# EAGLE design 4HP_555_eg (EAGLE 8.1.1)
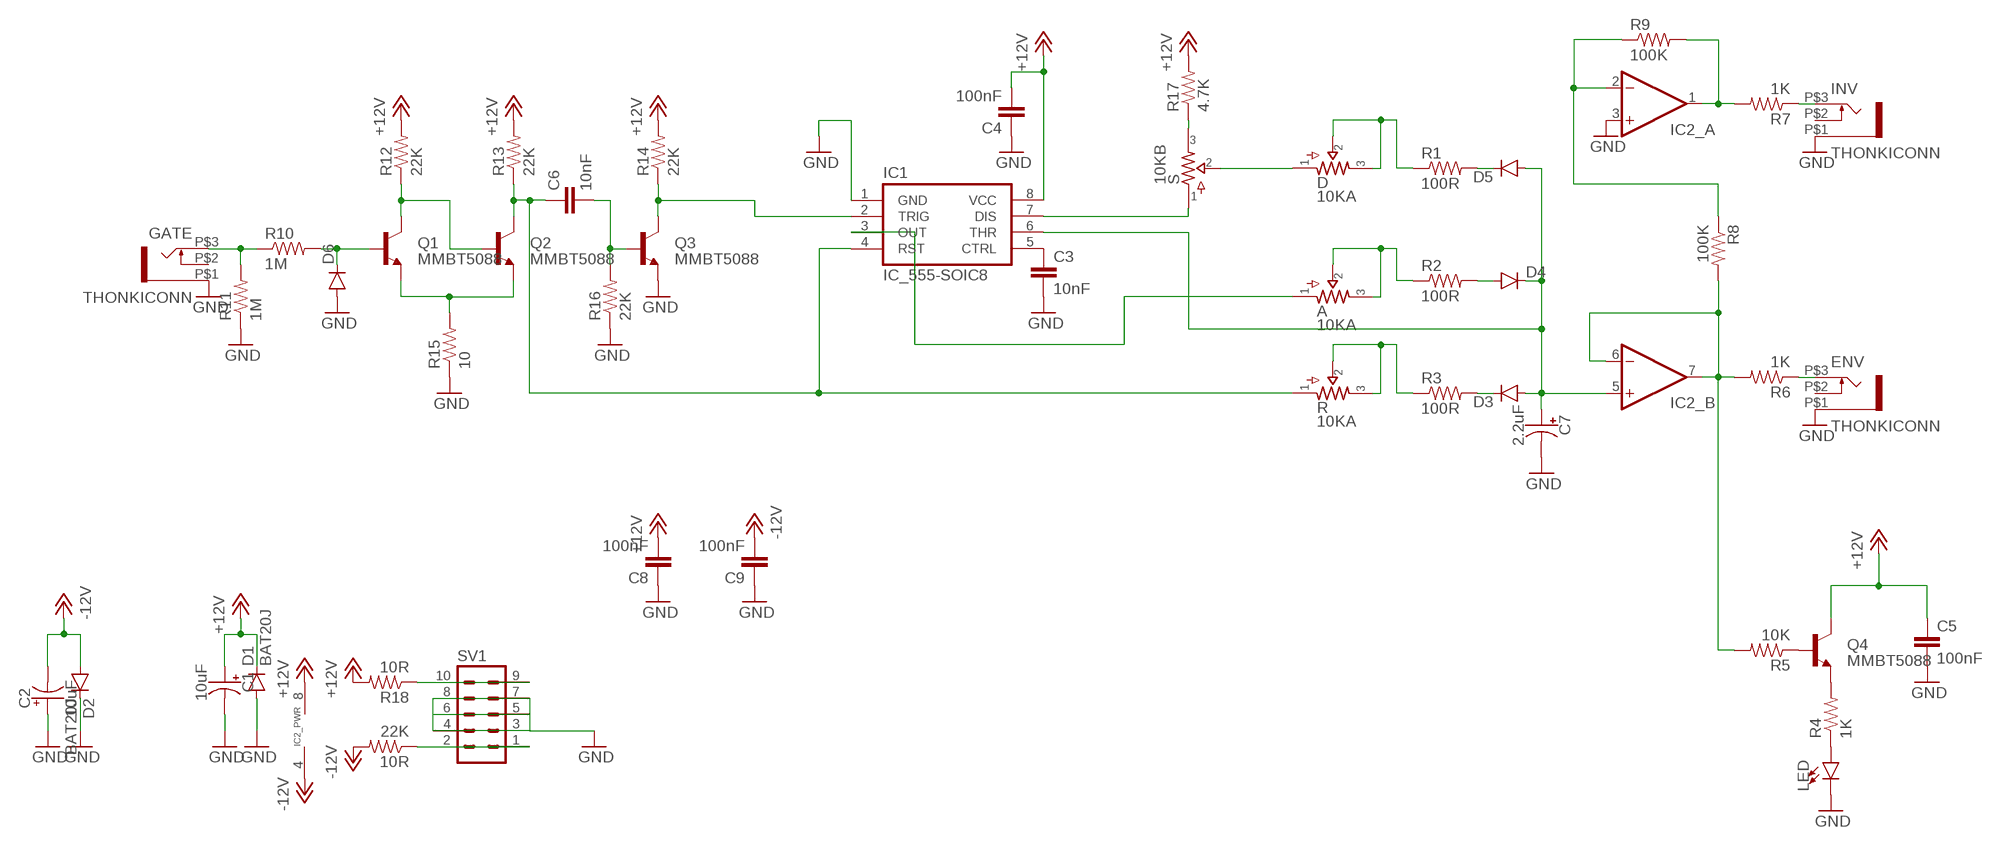
[diagram p0: schematic, sheet 1]

## Parts
10R  22K  RESISTOR0603-RES  [0603-RES]
A  10KA  POTS9MM_MOUNTED_2MMH  [9MM_W/MOUNTS-2MMHOLES]
C1  10uF  0501  [050_020_1]
C2  10uF  0501  [050_020_1]
C3  10nF  CAP0603-CAP  [0603-CAP]
C4  100nF  CAP0603-CAP  [0603-CAP]
C5  100nF  CAP0603-CAP  [0603-CAP]
C6  10nF  CAP0603-CAP  [0603-CAP]
C7  2.2uF  0501  [050_020_1]
C8  100nF  CAP0603-CAP  [0603-CAP]
C9  100nF  CAP0603-CAP  [0603-CAP]
D  10KA  POTS9MM_MOUNTED_2MMH  [9MM_W/MOUNTS-2MMHOLES]
D1  BAT20J  DIODESOD123  [SOD-123]
D2  BAT20J  DIODESOD123  [SOD-123]
D3  DIODESOD  [SOD-323]
D4  DIODESOD  [SOD-323]
D5  DIODESOD  [SOD-323]
D6  DIODESOD  [SOD-323]
ENV  THONKICONN  [THONKICONN]
GATE  THONKICONN  [THONKICONN]
IC1  IC_555-SOIC8  [SOIC-8]
IC2  DUALSMD  [SO08]
INV  THONKICONN  [THONKICONN]
LED  LED5MM  [LED_5MM]
Q1  MMBT5088  TRANSISTOR_NPNMMBT5088  [SOT23]
Q2  MMBT5088  TRANSISTOR_NPNMMBT5088  [SOT23]
Q3  MMBT5088  TRANSISTOR_NPNMMBT5088  [SOT23]
Q4  MMBT5088  TRANSISTOR_NPNMMBT5088  [SOT23]
R  10KA  POTS9MM_MOUNTED_2MMH  [9MM_W/MOUNTS-2MMHOLES]
R1  100R  RESISTOR0603-RES  [0603-RES]
R2  100R  RESISTOR0603-RES  [0603-RES]
R3  100R  RESISTOR0603-RES  [0603-RES]
R4  1K  RESISTOR0603-RES  [0603-RES]
R5  10K  RESISTOR0603-RES  [0603-RES]
R6  1K  RESISTOR0603-RES  [0603-RES]
R7  1K  RESISTOR0603-RES  [0603-RES]
R8  100K  RESISTOR0603-RES  [0603-RES]
R9  100K  RESISTOR0603-RES  [0603-RES]
R10  1M  RESISTOR0603-RES  [0603-RES]
R11  1M  RESISTOR0603-RES  [0603-RES]
R12  22K  RESISTOR0603-RES  [0603-RES]
R13  22K  RESISTOR0603-RES  [0603-RES]
R14  22K  RESISTOR0603-RES  [0603-RES]
R15  10  RESISTOR0603-RES  [0603-RES]
R16  22K  RESISTOR0603-RES  [0603-RES]
R17  4.7K  RESISTOR0603-RES  [0603-RES]
R18  10R  RESISTOR0603-RES  [0603-RES]
S  10KB  POTS9MM_MOUNTED_2MMH  [9MM_W/MOUNTS-2MMHOLES]
SV1  EURO_POWER_HEADER  [EURO_POWER_HEADER]

## Nets
+12V: C1.+ C4.2 C5.1 C8.2 D1.C IC1.8(VCC) IC2.8(_PWR:V+) Q4.3(C) R12.2 R13.2 R14.2 R17.2 R18.2
-12V: 10R.2 C2.- C9.2 D2.A IC2.4(_PWR:V-)
CTRL: C3.1 IC1.5(CTRL)
GND: C1.- C2.+ C3.2 C4.1 C5.2 C7.- C8.1 C9.1 D1.A D2.C D6.A ENV.P$1 GATE.P$1 IC1.1(GND) IC2.3(_A:+IN) INV.P$1 LED.K(C) Q3.2(E) R11.1 R15.1 R16.1 SV1.3 SV1.4 SV1.5 SV1.6 SV1.7 SV1.8
N$1: IC2.6(_B:-IN) IC2.7(_B:OUT) R5.2 R6.2 R8.2
N$2: C7.+ D3.A D4.C D5.A IC1.6(THR) IC2.5(_B:+IN)
N$3: D5.C R1.2
N$4: D4.A R2.2
N$5: D3.C R3.2
N$6: D.P$2 D.P$3 R1.1
N$7: A.P$2 A.P$3 R2.1
N$8: R3.1 R.P$2 R.P$3
N$9: Q4.2(E) R4.2
N$10: LED.A R4.1
N$11: R18.1 SV1.9 SV1.10
N$12: 10R.1 SV1.1 SV1.2
N$13: D.P$1 S.P$2
N$14: IC1.7(DIS) S.P$1
N$15: A.P$1 IC1.3(OUT)
N$16: IC1.2(TRIG) Q3.3(C) R14.1
N$17: Q1.3(C) Q2.1(B) R12.1
N$18: Q4.1(B) R5.1
N$19: ENV.P$3 R6.1
N$20: INV.P$3 R7.1
N$21: IC2.1(_A:OUT) R7.2 R9.2
N$22: IC2.2(_A:-IN) R8.1 R9.1
N$23: Q1.2(E) Q2.2(E) R15.2
N$24: GATE.P$3 R10.1 R11.2
N$25: D6.C Q1.1(B) R10.2
N$26: C6.1 IC1.4(RST) Q2.3(C) R13.1 R.P$1
N$27: C6.2 Q3.1(B) R16.2
N$28: R17.1 S.P$3
Unconnected: ENV.P$2 GATE.P$2 INV.P$2

## Library data of the parts
10R R1-R18 = SparkFun-Passives:RESISTOR: Resistor Basic schematic elements and footprints for 0603, 1206, and PTH resistors.
A D R S = potentiometers:POTS
C1 C2 C7 = capacitors-elec:050: 0.22 - 100uF Xicon values at Mouser.com: 10V: 10 - 100uF; 16V: 2.2 - 47uF; 25V: 0.47 - 47uF; 50V: 0.22 - 22uF
C3-C6 C8 C9 = SparkFun-Capacitors:CAP: Capacitor Standard 0603 ceramic capacitor, and 0.1" leaded capacitor.
D1 D2 = SparkFun-DiscreteSemi:DIODE: Diode These are standard reverse protection diodes and small signal diodes. SMA package can handle up to about 1A. SOD-323 can handle about 200mA. What the SOD-323 package when ordering, there are some mfgs out there that are 5-pin packages.
D3-D6 = SparkFun-DiscreteSemi:DIODE: Diode These are standard reverse protection diodes and small signal diodes. SMA package can handle up to about 1A. SOD-323 can handle about 200mA. What the SOD-323 package when ordering, there are some mfgs out there that are 5-pin packages.; PROD_ID: DIO-09646
ENV GATE INV = MusicThingModular:THONKICONN
IC1 = dp_devices:IC_555: Classic 555 IC
IC2 = integrated circuits:DUAL: OP AMP
LED = SparkFun-LED:LED: LED (Generic) Standard schematic elements and footprints for 5mm, 3mm, 1206, and 0603 sized LEDs. Generic LEDs with no color specified.
Q1-Q4 = SparkFun-DiscreteSemi:TRANSISTOR_NPN: Generic NPN BJT MMBT2222A - TRANS-08049 (SOT-23, 1A 40V) MPSA42 - TRANS-09116 (SOT-23, 500mA 300V) MMBT5088LT1G - TRANS-11160 (SOT-23, 50 mA 30V) BC547 - COM-08928 <http://www.sparkfun.com/products/8928> (TO-92 45V 100mA) (1.Collector 2.Base 3.Emitter) 2N3904 - COM-00521 <http://www.sparkfun.com/products/521> (TO-92 40V 200mA) (1.Emitter 2.Base 3.Collector) P2N2222A - COM-12852 <http://www.sparkfun.com/products/12852> (TO-92 40V 600mA) (1.Collector 2.Base 3.Emitter); PROD_ID: TRANS-11160
SV1 = MusicThingModular:EURO_POWER_HEADER: Power Header 10 pin power header for Eurorack Power Supplies

## Board
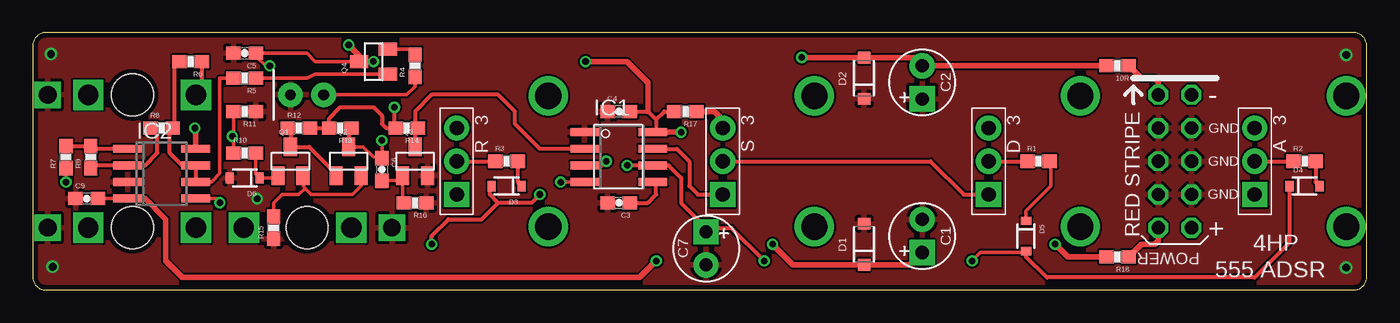
[diagram p1: board, top side]
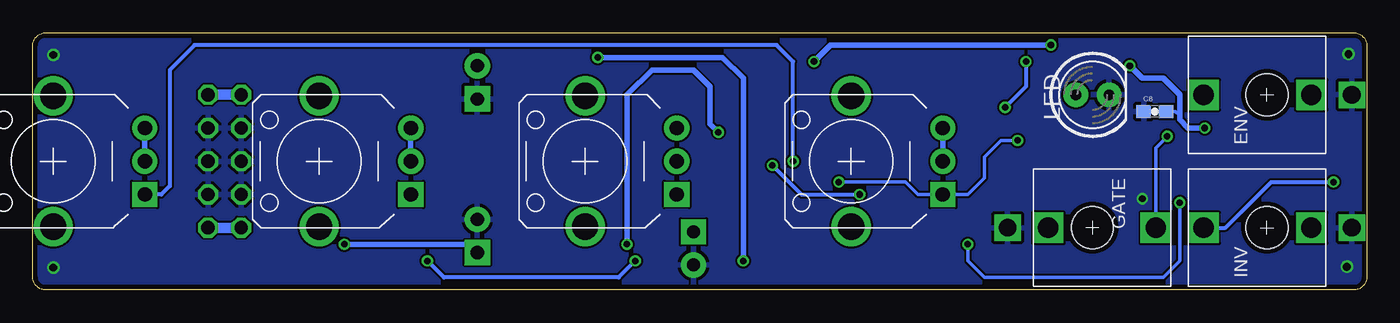
[diagram p2: board, bottom side, seen from below]

Size 101.91 x 19.68 mm. Coordinates in mm from the lower left corner, seen from the top.
Outline: 0,18.67 0,1 arc90 1,0 100.91,0 arc90 101.91,1 101.91,18.67 arc90 100.91,19.67 1,19.67 arc90 0,18.67
Copper layers (1*16): Top 0.0356mm / dielectric 1.5011mm / Bottom 0.0356mm
Design rules "LaenPCBOrder": minimum track width 6mil, minimum drill 13mil, track to track 6mil, track to pad 6mil, pad to pad 6mil, via to via 6mil, smd to smd 6mil, copper to edge 15mil, drill to drill 6mil, minimum pad ring 7mil, minimum via ring 7mil, stop-mask expansion 3mil, vias tented up to drill 0mil, thermal gap 10mil
Holes 3.2 mm at 7.62,14.92 20.95,4.76 7.62,4.76

### Footprints (pad centres in the part's own frame; a part is rotated, then mirrored left to right if it is on the bottom)
0603-RES = smd 1.1 x 1: 1 -0.85,0; 2 0.85,0
9MM_W/MOUNTS-2MMHOLES = drill 1.1 pad 1.93 square: P$1 2.54,0 | drill 1.1 pad 1.93: P$2 0,0; P$3 -2.54,0 | drill 2: P$4 -5,7; P$5 5,7
050_020_1 = drill 1 pad 1.93 square: + -1.27,0 | drill 1 pad 1.93: - 1.27,0
0603-CAP = smd 1.1 x 1: 1 -0.85,0; 2 0.85,0
SOD-123 = smd 0.9 x 0.95: A 1.575,0; C -1.575,0
SOD-323 = smd 0.63 x 0.83: A 1.15,0; C -1.15,0
THONKICONN = drill 1.35 square: P$1 0,-6.48 | drill 1.55 square: P$2 0,-3.38; P$3 0,4.84
SOIC-8 = smd 0.6 x 2.2: 1 -1.905,-2.6; 2 -0.635,-2.6; 3 0.635,-2.6; 4 1.905,-2.6; 5 1.905,2.6; 6 0.635,2.6; 7 -0.635,2.6; 8 -1.905,2.6
SO08 = smd 0.6 x 2.2: 1 -1.905,-2.6; 2 -0.635,-2.6; 3 0.635,-2.6; 4 1.905,-2.6; 5 1.905,2.6; 6 0.635,2.6; 7 -0.635,2.6; 8 -1.905,2.6
LED_5MM = drill 0.813 pad 1.88: A -1.27,0; K 1.27,0
SOT23 = smd 1 x 1.4: 1 -0.95,-1.1; 2 0.95,-1.1; 3 0,1.1
EURO_POWER_HEADER = drill 1.016 octagon: 1 -5.08,-1.27; 2 -5.08,1.27; 3 -2.54,-1.27; 4 -2.54,1.27; 5 0,-1.27; 6 0,1.27; 7 2.54,-1.27; 8 2.54,1.27; 9 5.08,-1.27; 10 5.08,1.27

### Placement (x,y rotation side)
10R  82.87,17.14 180 top
A  93.34,9.84 270 top
C1  67.94,4.13 90 top
C2  67.94,15.87 90 top
C3  44.77,6.67 180 top
C4  44.77,13.65 0 top
C5  16.19,18.1 180 top
C6  26.67,9.21 270 top
C7  51.44,3.18 270 top
C8  16.19,13.65 0 bottom
C9  4.13,6.99 0 top
D  73.02,9.84 270 top
D1  63.5,3.49 90 top
D2  63.5,16.19 90 top
D3  36.2,7.94 180 top
D4  97.16,7.94 0 top
D5  75.88,4.13 270 top
D6  16.19,8.57 180 top
ENV  7.62,14.92 90 bottom
GATE  20.95,4.76 270 bottom
IC1  44.77,10.16 270 top
IC2  9.84,8.89 270 top
INV  7.62,4.76 90 bottom
LED  20.95,14.92 0 bottom
Q1  19.68,9.84 0 top
Q2  24.13,9.84 0 top
Q3  29.21,9.84 0 top
Q4  26.04,17.46 90 top
R  32.39,9.84 270 top
R1  76.83,9.84 0 top
R2  97.16,9.84 0 top
R3  36.2,9.84 0 top
R4  29.21,17.14 90 top
R5  16.19,16.19 180 top
R6  12.06,17.46 180 top
R7  2.54,10.16 90 top
R8  9.84,12.38 0 top
R9  4.45,10.16 90 top
R10  16.19,10.48 0 top
R11  16.19,13.65 180 top
R12  20.32,12.38 0 top
R13  23.49,12.38 180 top
R14  28.57,12.38 180 top
R15  18.41,4.76 90 top
R16  29.21,6.67 180 top
R17  49.85,13.65 180 top
R18  82.87,2.54 180 top
S  52.71,9.84 270 top
SV1  87.25,9.84 270 top

### Tracks (layer width: path | path; a pad name or v marks a point on that pad's centre or on a via)
+12V  (via drill 0.5)
  Top 0.254: Q4.3 21.59,17.46 20.95,18.1 C5.1 16.83,18.1 16.83,17.78 17.14,17.78 17.78,17.14 v18.1,17.14
  Top 0.305: C4.2 46.99,13.65 47.62,13.02 | 47.62,13.02 47.62,12.32 IC1.8 | 47.62,13.02 48.26,13.65 R17.2 | R12.2 R13.2 22.64,13.12 23.49,13.97 26.04,13.97 26.67,13.33 26.67,12.7 26.99,12.38 R14.2 27.62,12.49 v27.62,13.97 | Q4.3 v26.04,17.46
  Top 0.406: C1.+ 67,1.92 D1.C 58.09,1.92 v56.52,3.49 | v49.53,12.07 IC1.8 | Q4.3 24.93,17.93 v24.13,18.73 | v42.23,17.46 45.4,17.46 46.99,15.87 46.99,13.65 | IC2.8 12.44,12.32 v12.38,12.38 | R18.2 79.06,2.54 v78.1,3.49
  Bottom 0.254: C8.2 14.61,13.65 14.29,13.33
  Bottom 0.305: v26.04,17.46 26.04,15.56 v27.62,13.97
  Bottom 0.406: v56.52,3.49 56.52,14.92 54.61,16.83 51.44,16.83 50.16,15.56 50.16,12.7 v49.53,12.07 | v24.13,18.73 40.96,18.73 v42.23,17.46 | v12.38,12.38 13.65,12.38 14.29,13.02 14.29,13.33 14.29,14.92 15.56,16.19 17.14,16.19 v18.1,17.14 | v78.1,3.49 68.58,3.49 C1.+
-12V  (via drill 0.5)
  Top 0.254: C9.2 IC2.4
  Top 0.406: IC2.4 8.57,6.99 10.16,5.4 10.16,2.22 11.43,0.95 46.36,0.95 v47.62,2.22 | v58.74,17.78 62.85,17.78 D2.A 67.32,17.77 C2.- 10R.2
  Bottom 0.406: v47.62,2.22 47.62,16.19 49.21,17.78 v58.74,17.78
CTRL
  Top 0.305: C3.1 46.99,6.67 47.62,7.3 47.62,8 IC1.5
GND  (via drill 0.5, 0.6)
  other vias: 100.33,17.97 1.52,1.78 1.4,18.03 100.33,1.71 17.14,6.99
  pour Bottom: -5.71,25.08 114.93,25.08 114.93,-1.59 -5.71,-1.59
  pour Top: -10.79,22.54 111.12,22.54 111.12,-4.13 -10.79,-4.13
N$1
  Top 0.254: R5.2 14.29,16.19 14.29,8.89 13.65,8.25 IC2.6
  Top 0.305: IC2.6 IC2.7 11.43,9.52 10.48,10.48 10.48,12.17 R8.2 10.79,12.49 10.79,17.14 R6.2
N$2  (via drill 0.5)
  Top 0.254: IC2.5 13.97,6.99 v14.29,6.67 | C7.+ 51.44,4.76 | v71.75,2.22 72.39,2.86 75.76,2.86 D5.A
  Top 0.305: v45.4,9.52 IC1.6 48.58,9.52 49.53,8.57 49.53,6.67 51.44,4.76 53.34,4.76 v55.88,2.22 | v38.73,7.3 38.1,6.67 35.56,6.67 | 35.56,6.67 34.93,7.3 34.93,7.82 D3.A | v30.48,3.49 30.48,4.13 31.75,5.4 34.29,5.4 35.56,6.67 | D4.C 96,3.61 93.34,0.95 77.47,0.95 75.88,2.54 D5.A
  Bottom 0.254: v14.29,6.67 14.29,2.22 15.56,0.95 29.21,0.95 30.48,2.22 v30.48,3.49
  Bottom 0.305: v45.4,9.52 43.18,7.3 v38.73,7.3 | v55.88,2.22 57.15,0.95 70.48,0.95 v71.75,2.22
N$3
  Top 0.254: D5.C 75.88,6.03 77.79,7.94 77.79,9.74 R1.2
N$4
  Top 0.305: R2.2 98,8.24 D4.A
N$5
  Top 0.305: R3.2 37.05,8.24 D3.C
N$6
  Top 0.305: D.P$2 R1.1
  Bottom 0.406: D.P$3 D.P$2
N$7
  Top 0.305: A.P$2 R2.1
  Bottom 0.406: A.P$3 A.P$2
N$8
  Top 0.305: R.P$2 R3.1
  Bottom 0.406: R.P$3 R.P$2
N$9
  Top 0.254: Q4.2 29.21,18.41 R4.2
N$10
  Top 0.254: LED.A 28.57,14.92 29.21,15.56 R4.1
N$11
  Top 0.406: SV1.9 85.98,3.75 85.72,3.49 84.67,3.49 R18.1
  Bottom 0.813: SV1.10 SV1.9
N$12
  Top 0.406: SV1.1 85.98,15.94 85.72,16.19 84.67,16.19 10R.1
  Bottom 0.813: SV1.2 SV1.1
N$13
  Top 0.305: S.P$2 68.58,9.84 71.12,7.3 D.P$1
N$14
  Top 0.305: IC1.7 49.21,10.8 50.16,9.84 50.16,7.94 50.8,7.3 S.P$1
N$15  (via drill 0.5)
  Top 0.305: IC1.3 43.5,9.52 v43.82,9.84
  Bottom 0.305: v43.82,9.84 43.82,17.46 45.09,18.73 89.53,18.73 91.44,16.83 91.44,7.94 92.07,7.3 A.P$1
N$16
  Top 0.305: IC1.2 38.73,10.8 36.83,12.7 36.83,13.65 35.56,14.92 30.48,14.92 29.21,13.65 29.21,12.38 | 29.21,12.38 Q3.3 | R14.1 29.21,12.38
N$17
  Top 0.254: Q2.1 23.18,8.57
  Top 0.305: Q2.1 23.18,8.89 21.12,10.94 Q1.3 19.68,12.17 R12.1
N$18
  Top 0.254: R5.1 20.95,16.19 21.59,16.51 Q4.1
N$19
  Top 0.305: R6.1 12.92,15.38 ENV.P$3
N$20  (via drill 0.5)
  Top 0.305: v2.54,8.25 R7.1
  Bottom 0.305: INV.P$3 10.79,4.76 7.3,8.25 v2.54,8.25
N$21
  Top 0.305: IC2.1 4.55,10.8 R9.2 R7.2
N$22
  Top 0.305: R8.1 9.53,11.85 9.53,10.48 8.57,9.52 IC2.2 4.98,9.52 R9.1
N$23
  Top 0.254: Q2.2 25.08,7.93 24.45,7.3 21.27,7.3 20.8,7.78 | 20.8,7.78 20.64,7.94 Q1.2 | R15.2 18.41,6.67 19.05,7.3 20.32,7.3 20.8,7.78
N$24  (via drill 0.5)
  Top 0.254: R10.1 15.34,11.65 v15.24,11.75 15.34,11.85 R11.2
  Bottom 0.254: GATE.P$3 16.11,10.87 v15.24,11.75
N$25
  Top 0.254: R10.2 17.04,8.87 D6.C 18.56,8.57
  Top 0.305: 17.36,8.59 D6.C | 18.56,8.57 Q1.1
N$26  (via drill 0.5)
  Top 0.254: Q2.3 25.25,10.94 26.04,10.16 26.67,10.16 C6.1 v26.67,11.43 | IC1.4 v40.32,8.25
  Top 0.305: R13.1 24.13,12.17 Q2.3
  Bottom 0.254: v40.32,8.25 35.24,8.25 34.29,7.3 R.P$1 30.48,7.3 29.21,8.57 29.21,10.16 27.94,11.43 v26.67,11.43
N$27
  Top 0.254: R16.2 28.26,6.77 Q3.1 27.88,8.36 C6.2
N$28
  Top 0.406: S.P$3 52.71,13.02 52.07,13.65 R17.1

### Text on the board
tPlace: 4HP | 555 ADSR